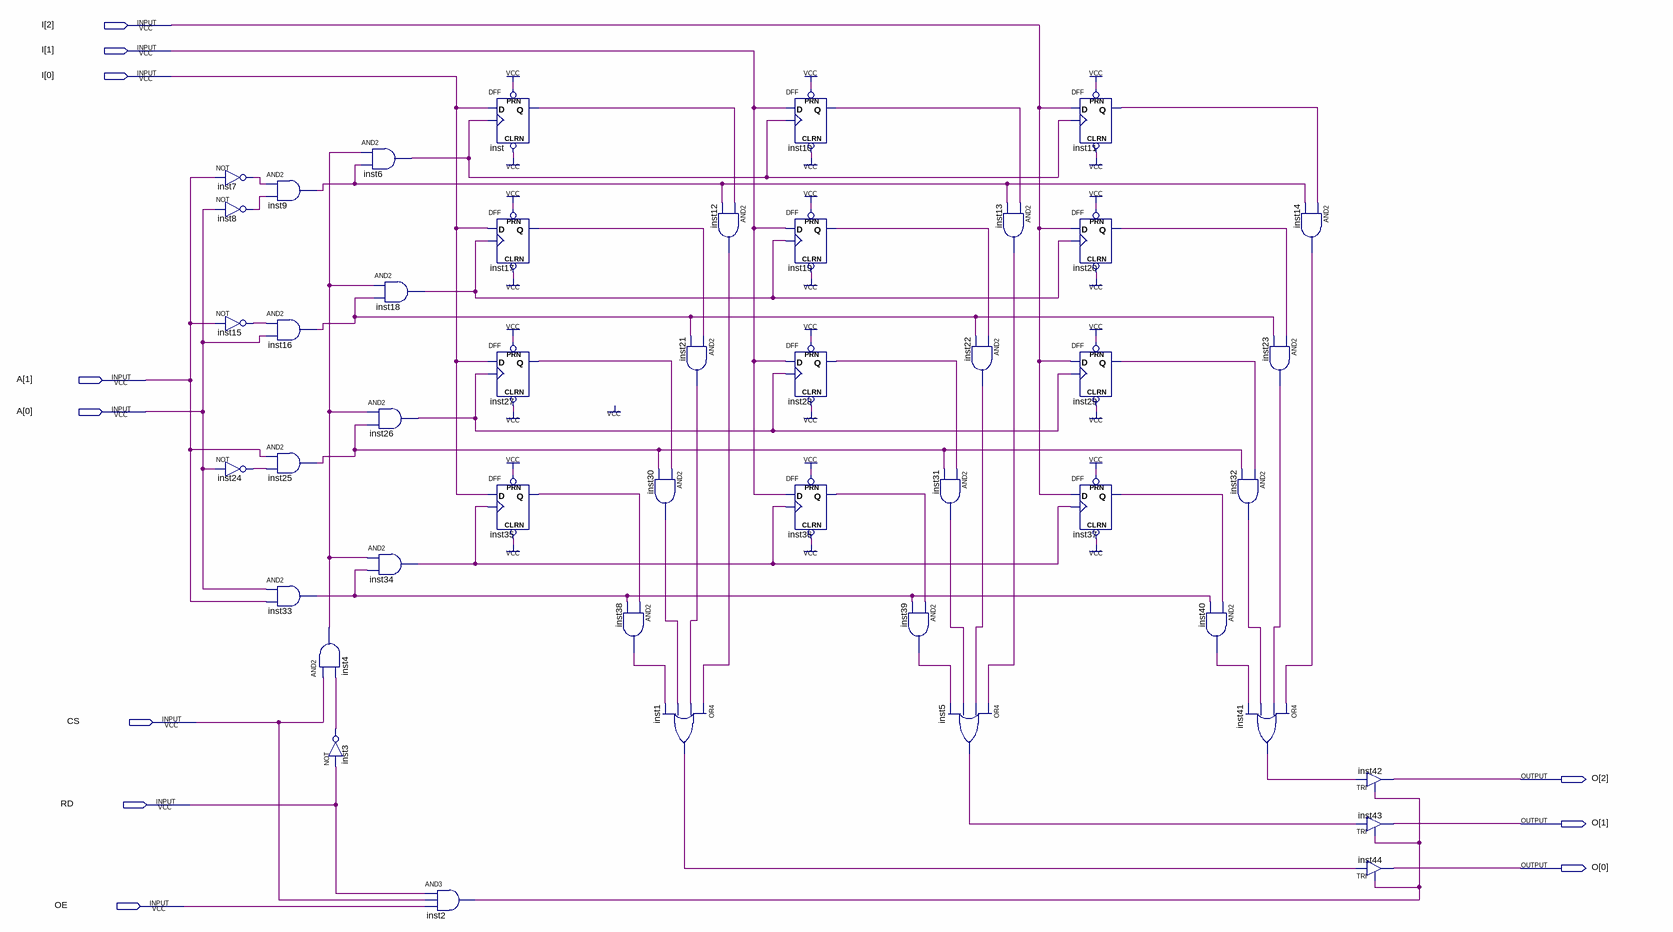
[diagram p0: schematic sheet]
// Quartus schematic mem_4x3.bdf as structural Verilog: 45 symbols, 11 pins
module mem_4x3 (
  input  [2:0] I,
  input  [1:0] A,
  input  CS,
  input  RD,
  input  OE,
  output [2:0] O
);

  wire inst1_out, inst2_out, inst3_out, inst4_out, inst5_out, inst6_out, inst7_out, inst8_out, inst9_out,
       inst10_q, inst11_q, inst12_out, inst13_out, inst14_out, inst15_out, inst16_out, inst17_q, inst18_out,
       inst19_q, inst20_q, inst21_out, inst22_out, inst23_out, inst24_out, inst25_out, inst26_out, inst27_q,
       inst28_q, inst29_q, inst30_out, inst31_out, inst32_out, inst33_out, inst34_out, inst35_q, inst36_q,
       inst37_q, inst38_out, inst39_out, inst40_out, inst41_out, inst_q;

  not inst7 (inst7_out, A[1]);
  not inst8 (inst8_out, A[0]);
  not inst15 (inst15_out, A[1]);
  not inst24 (inst24_out, A[0]);
  and inst9 (inst9_out, inst7_out, inst8_out);
  and inst16 (inst16_out, inst15_out, A[0]);
  and inst25 (inst25_out, A[1], inst24_out);
  and inst33 (inst33_out, A[0], A[1]);
  and inst4 (inst4_out, CS, inst3_out);
  not inst3 (inst3_out, RD);
  and inst6 (inst6_out, inst4_out, inst9_out);
  and inst18 (inst18_out, inst4_out, inst16_out);
  and inst26 (inst26_out, inst4_out, inst25_out);
  and inst34 (inst34_out, inst4_out, inst33_out);
  and inst2 (inst2_out, RD, CS, OE);
  DFF inst (.CLRN(1'b1), .CLK(inst6_out), .D(I[0]), .PRN(1'b1), .Q(inst_q));
  DFF inst17 (.CLRN(1'b1), .CLK(inst18_out), .D(I[0]), .PRN(1'b1), .Q(inst17_q));
  DFF inst27 (.CLRN(1'b1), .CLK(inst26_out), .D(I[0]), .PRN(1'b1), .Q(inst27_q));
  DFF inst35 (.CLRN(1'b1), .CLK(inst34_out), .D(I[0]), .PRN(1'b1), .Q(inst35_q));
  and inst30 (inst30_out, inst27_q, inst25_out);
  and inst38 (inst38_out, inst35_q, inst33_out);
  and inst21 (inst21_out, inst17_q, inst16_out);
  or inst1 (inst1_out, inst12_out, inst21_out, inst30_out, inst38_out);
  and inst12 (inst12_out, inst_q, inst9_out);
  DFF inst10 (.CLRN(1'b1), .CLK(inst6_out), .D(I[1]), .PRN(1'b1), .Q(inst10_q));
  DFF inst19 (.CLRN(1'b1), .CLK(inst18_out), .D(I[1]), .PRN(1'b1), .Q(inst19_q));
  DFF inst28 (.CLRN(1'b1), .CLK(inst26_out), .D(I[1]), .PRN(1'b1), .Q(inst28_q));
  DFF inst36 (.CLRN(1'b1), .CLK(inst34_out), .D(I[1]), .PRN(1'b1), .Q(inst36_q));
  and inst39 (inst39_out, inst36_q, inst33_out);
  and inst31 (inst31_out, inst28_q, inst25_out);
  or inst5 (inst5_out, inst13_out, inst22_out, inst31_out, inst39_out);
  and inst13 (inst13_out, inst10_q, inst9_out);
  and inst22 (inst22_out, inst19_q, inst16_out);
  DFF inst11 (.CLRN(1'b1), .CLK(inst6_out), .D(I[2]), .PRN(1'b1), .Q(inst11_q));
  DFF inst20 (.CLRN(1'b1), .CLK(inst18_out), .D(I[2]), .PRN(1'b1), .Q(inst20_q));
  DFF inst29 (.CLRN(1'b1), .CLK(inst26_out), .D(I[2]), .PRN(1'b1), .Q(inst29_q));
  DFF inst37 (.CLRN(1'b1), .CLK(inst34_out), .D(I[2]), .PRN(1'b1), .Q(inst37_q));
  and inst40 (inst40_out, inst37_q, inst33_out);
  and inst32 (inst32_out, inst29_q, inst25_out);
  or inst41 (inst41_out, inst14_out, inst23_out, inst32_out, inst40_out);
  and inst14 (inst14_out, inst11_q, inst9_out);
  and inst23 (inst23_out, inst20_q, inst16_out);
  TRI inst42 (.IN(inst41_out), .OE(inst2_out), .OUT(O[2]));
  TRI inst43 (.IN(inst5_out), .OE(inst2_out), .OUT(O[1]));
  TRI inst44 (.IN(inst1_out), .OE(inst2_out), .OUT(O[0]));
endmodule
